# Altium schematic sheet WirelessModule.SchDoc
size A4
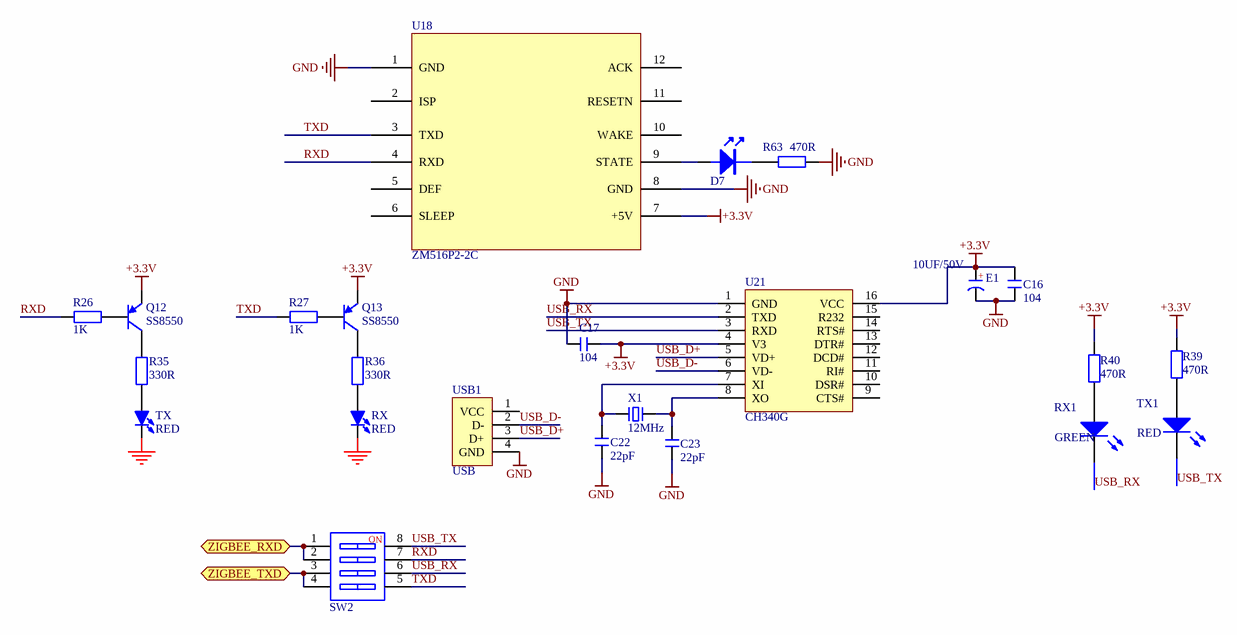
[diagram p0: WirelessModule.SchDoc]

## Parts
C16  104  [C 0805]
C17  104  [C 0805]
C22  22pF  [C 0805]
C23  22pF  [C 0805]
D7  RED  [LED 3MM-B]  (value not drawn)
E1  10UF/50V  [CAP 2.0*5*11]
Q12  SS8550  [SOT23-3N]
Q13  SS8550  [SOT23-3N]
R26  1K  [R 0805-HP]
R27  1K  [R 0805-HP]
R35  330R  [R 0805-HP]
R36  330R  [R 0805-HP]
R39  470R  [R 0805]
R40  470R  [R 0805]
R63  470R  [R 0805]
RX  RED  [LED 3MM-R]
RX1  GREEN  [LED 0805R]
SW2  CSW-4P  [CSW1.27 SMD-4P]  (value not drawn)
TX  RED  [LED 3MM-R]
TX1  RED  [LED 0805R]
U18  ZM516P2-2C  [ZM5168XP1-1C_ZJ]
U21  CH340G  [SO16]
USB1  USB  [USB-B/S_A]
X1  12MHz  [XTAL-5032 - 2P]

## Ports
ZIGBEE_RXD, ZIGBEE_TXD

## Nets
+3.3V: C16.2 C17.1 E1.1(A) Q12.2(E) Q13.2(E) R39.2 R40.2 U18.7(+5V) U21.4(V3) U21.16(VCC)
GND: C16.1 C17.2 C22.1 C23.1 E1.2(K) R63.2 RX.2(K) TX.2(K) U18.1(GND) U18.8(GND) U21.1(GND) USB1.4(GND)
RXD: R26.1 SW2.7 U18.4(RXD)
TXD: R27.1 SW2.5 U18.3(TXD)
USB_D+: U21.5(VD+) USB1.3(D+)
USB_D-: U21.6(VD-) USB1.2(D-)
USB_RX: RX1.2(K) SW2.6 U21.2(TXD)
USB_TX: SW2.8 TX1.2(K) U21.3(RXD)
ZIGBEE_RXD: SW2.1 SW2.2 ; port ZIGBEE_RXD
ZIGBEE_TXD: SW2.3 SW2.4 ; port ZIGBEE_TXD
NetC22_2: C22.2 U21.7(XI) X1.1
NetC23_2: C23.2 U21.8(XO) X1.2
NetD7_1: D7.1 U18.9(STATE)
NetD7_2: D7.2 R63.1
NetQ12_1: Q12.1(B) R26.2
NetQ12_3: Q12.3(C) R35.1
NetQ13_1: Q13.1(B) R27.2
NetQ13_3: Q13.3(C) R36.1
NetR35_2: R35.2 TX.1(A)
NetR36_2: R36.2 RX.1(A)
NetR39_1: R39.1 TX1.1(A)
NetR40_1: R40.1 RX1.1(A)

Not connected (* = marked no-connect by the designer): U18 2(ISP) 5(DEF) 6(SLEEP) 10(WAKE) 11(RESETN) 12(ACK); U21 9(CTS#) 10(DSR#) 11(RI#) 12(DCD#) 13(DTR#) 14(RTS#) 15(R232); USB1 1(VCC)

## Notes on the sheet
- 设 计
- 制 图
- 审 核
- 类 别
- 签  字
- 日 期
- 产 品
- 名 称
- 零 件
- 板  名
- 数  量
- 共  张
- 第  张
- 批 准
- 文件编号
- 沈阳市创奇游乐设备有限公司
- (in symbol C-CAP) +
- (in symbol CSW-4P) NO

## Library data of the parts
C16 C17 C22 C23 = C: 无极性贴片电容; 版权归属: 源创客; BOM名称: 无极性贴片电容; 学习资源: www.ooocke.com
D7 RX1 TX1 = LED
E1 = C-CAP: 直插电解电容; 版权归属: 源创客; BOM名称: 直插电解电容; 学习资源: www.ooocke.com
Q12 Q13 = 8550-SMD: 高频放大-PNP型; 版权归属: 源创客; 属性: 40V 1.5A 1W 100MHZ; BOM名称: 高频放大-PNP型; 学习资源: www.ooocke.com
R26 R27 R35 R36 R63 = R: 贴片电阻; 版权归属: 源创客; BOM名称: 贴片电阻; 学习资源: www.ooocke.com
R39 R40 = Res1
RX TX = LED-5MM: 5mm插件LED; 版权归属: 源创客; BOM名称: 5mm插件LED; 学习资源: www.ooocke.com
SW2 = CSW-4P: 4路编码开关; 版权归属: 源创客; BOM名称: 4路编码开关; 学习资源: www.ooocke.com
U18 = ZM516P2-2C转接
USB1 = USB-A/S: USB-A型母接口; 版权归属: 源创客; BOM名称: USB-A型母接口; 学习资源: www.ooocke.com
X1 = XTAL-2: 2脚晶振; 版权归属: 源创客; BOM名称: 2脚晶振; 学习资源: www.ooocke.com